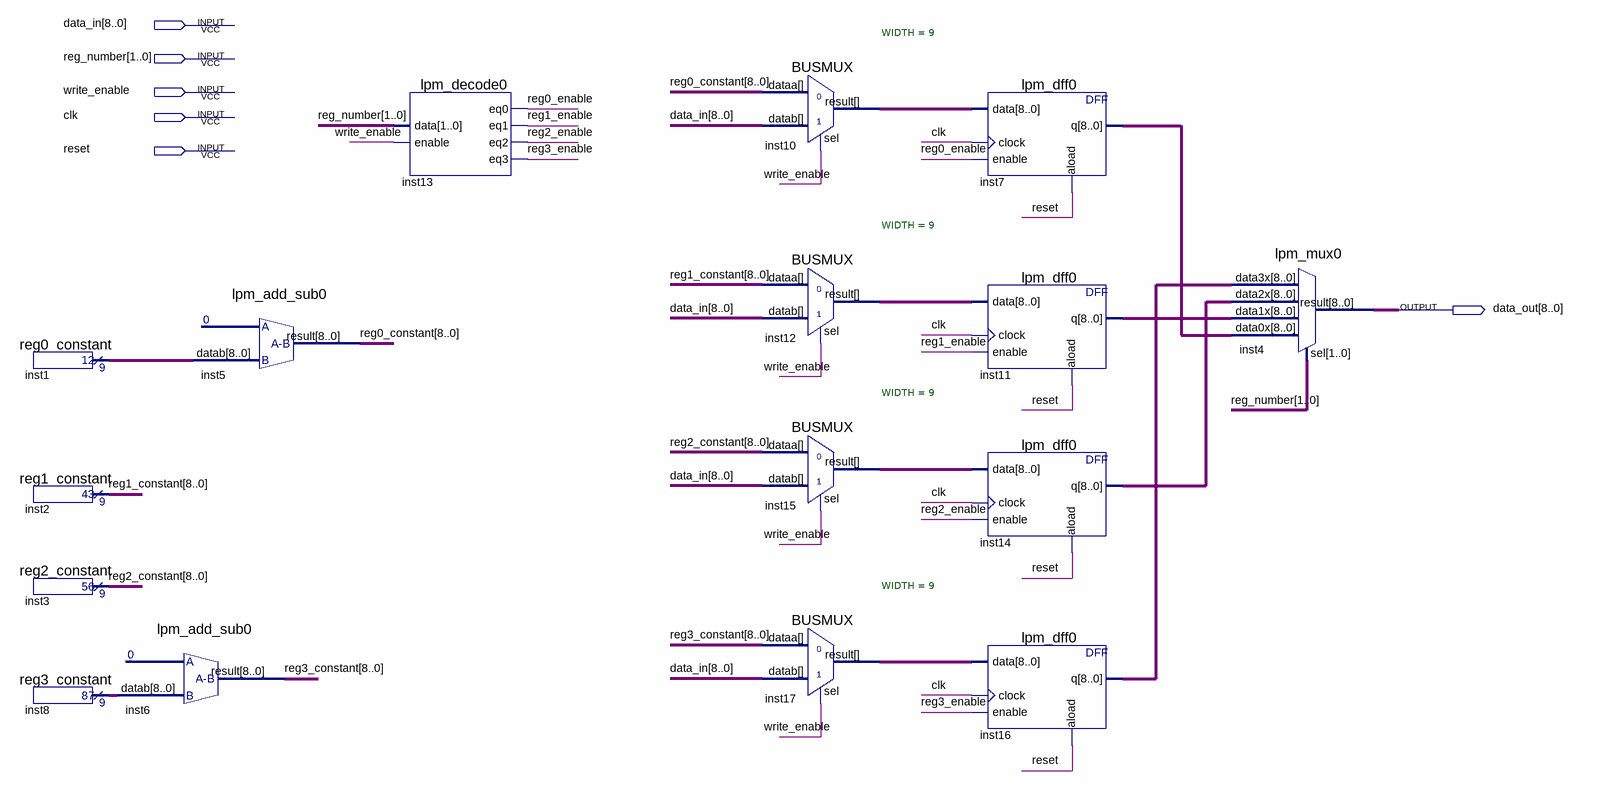
[diagram p0: schematic sheet]
// Quartus schematic GPR.bdf as structural Verilog: 16 symbols, 6 pins
module GPR (
  input  [8:0] data_in,
  input  [1:0] reg_number,
  input  write_enable,
  input  clk,
  input  reset,
  output [8:0] data_out
);

  wire reg0_enable, reg1_enable, reg2_enable, reg3_enable;
  wire [8:0] inst1_result, inst7_q, inst8_result, inst10_result, inst11_q, inst12_result, inst14_q,
       inst15_result, inst16_q, inst17_result, reg0_constant, reg1_constant, reg2_constant, reg3_constant;

  reg0_constant inst1 (.result(inst1_result));
  reg1_constant inst2 (.result(reg1_constant));
  reg2_constant inst3 (.result(reg2_constant));
  reg3_constant inst8 (.result(inst8_result));
  lpm_add_sub0 inst6 (.datab(inst8_result), .result(reg3_constant));
  lpm_add_sub0 inst5 (.datab(inst1_result), .result(reg0_constant));
  lpm_decode0 inst13 (
    .data(reg_number), .enable(write_enable), .eq0(reg0_enable), .eq1(reg1_enable), .eq2(reg2_enable),
    .eq3(reg3_enable));
  BUSMUX #(.WIDTH(9)) inst10 (.datab(data_in), .sel(write_enable), .dataa(reg0_constant), .result(inst10_result));
  BUSMUX #(.WIDTH(9)) inst12 (.datab(data_in), .sel(write_enable), .dataa(reg1_constant), .result(inst12_result));
  BUSMUX #(.WIDTH(9)) inst15 (.datab(data_in), .sel(write_enable), .dataa(reg2_constant), .result(inst15_result));
  BUSMUX #(.WIDTH(9)) inst17 (.datab(data_in), .sel(write_enable), .dataa(reg3_constant), .result(inst17_result));
  lpm_dff0 inst7 (.data(inst10_result), .clock(clk), .enable(reg0_enable), .aload(reset), .q(inst7_q));
  lpm_dff0 inst11 (.data(inst12_result), .clock(clk), .enable(reg1_enable), .aload(reset), .q(inst11_q));
  lpm_dff0 inst14 (.data(inst15_result), .clock(clk), .enable(reg2_enable), .aload(reset), .q(inst14_q));
  lpm_dff0 inst16 (.data(inst17_result), .clock(clk), .enable(reg3_enable), .aload(reset), .q(inst16_q));
  lpm_mux0 inst4 (
    .data3x(inst16_q), .data2x(inst14_q), .data1x(inst11_q), .data0x(inst7_q), .sel(reg_number),
    .result(data_out));
endmodule
